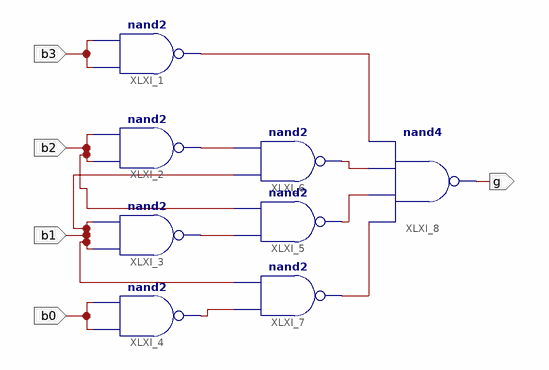
[diagram p0: schematic sheet 1]
// Xilinx ISE schematic g_block.sch (xc9500xl) as structural Verilog: 8 symbols, 5 ports
module g_block (
  input  b3,
  input  b2,
  input  b1,
  input  b0,
  output g
);

  wire XLXN_5, XLXN_6, XLXN_9, XLXN_17, XLXN_18, XLXN_19, XLXN_20;

  nand XLXI_1 (XLXN_18, b3, b3);
  nand XLXI_2 (XLXN_6, b2, b2);
  nand XLXI_3 (XLXN_5, b1, b1);
  nand XLXI_4 (XLXN_9, b0, b0);
  nand XLXI_5 (XLXN_19, XLXN_5, b2);
  nand XLXI_6 (XLXN_17, b1, XLXN_6);
  nand XLXI_7 (XLXN_20, XLXN_9, b1);
  nand XLXI_8 (g, XLXN_20, XLXN_19, XLXN_17, XLXN_18);
endmodule
